# EAGLE design usb_to_uart (EAGLE 5.07)
P1: RX
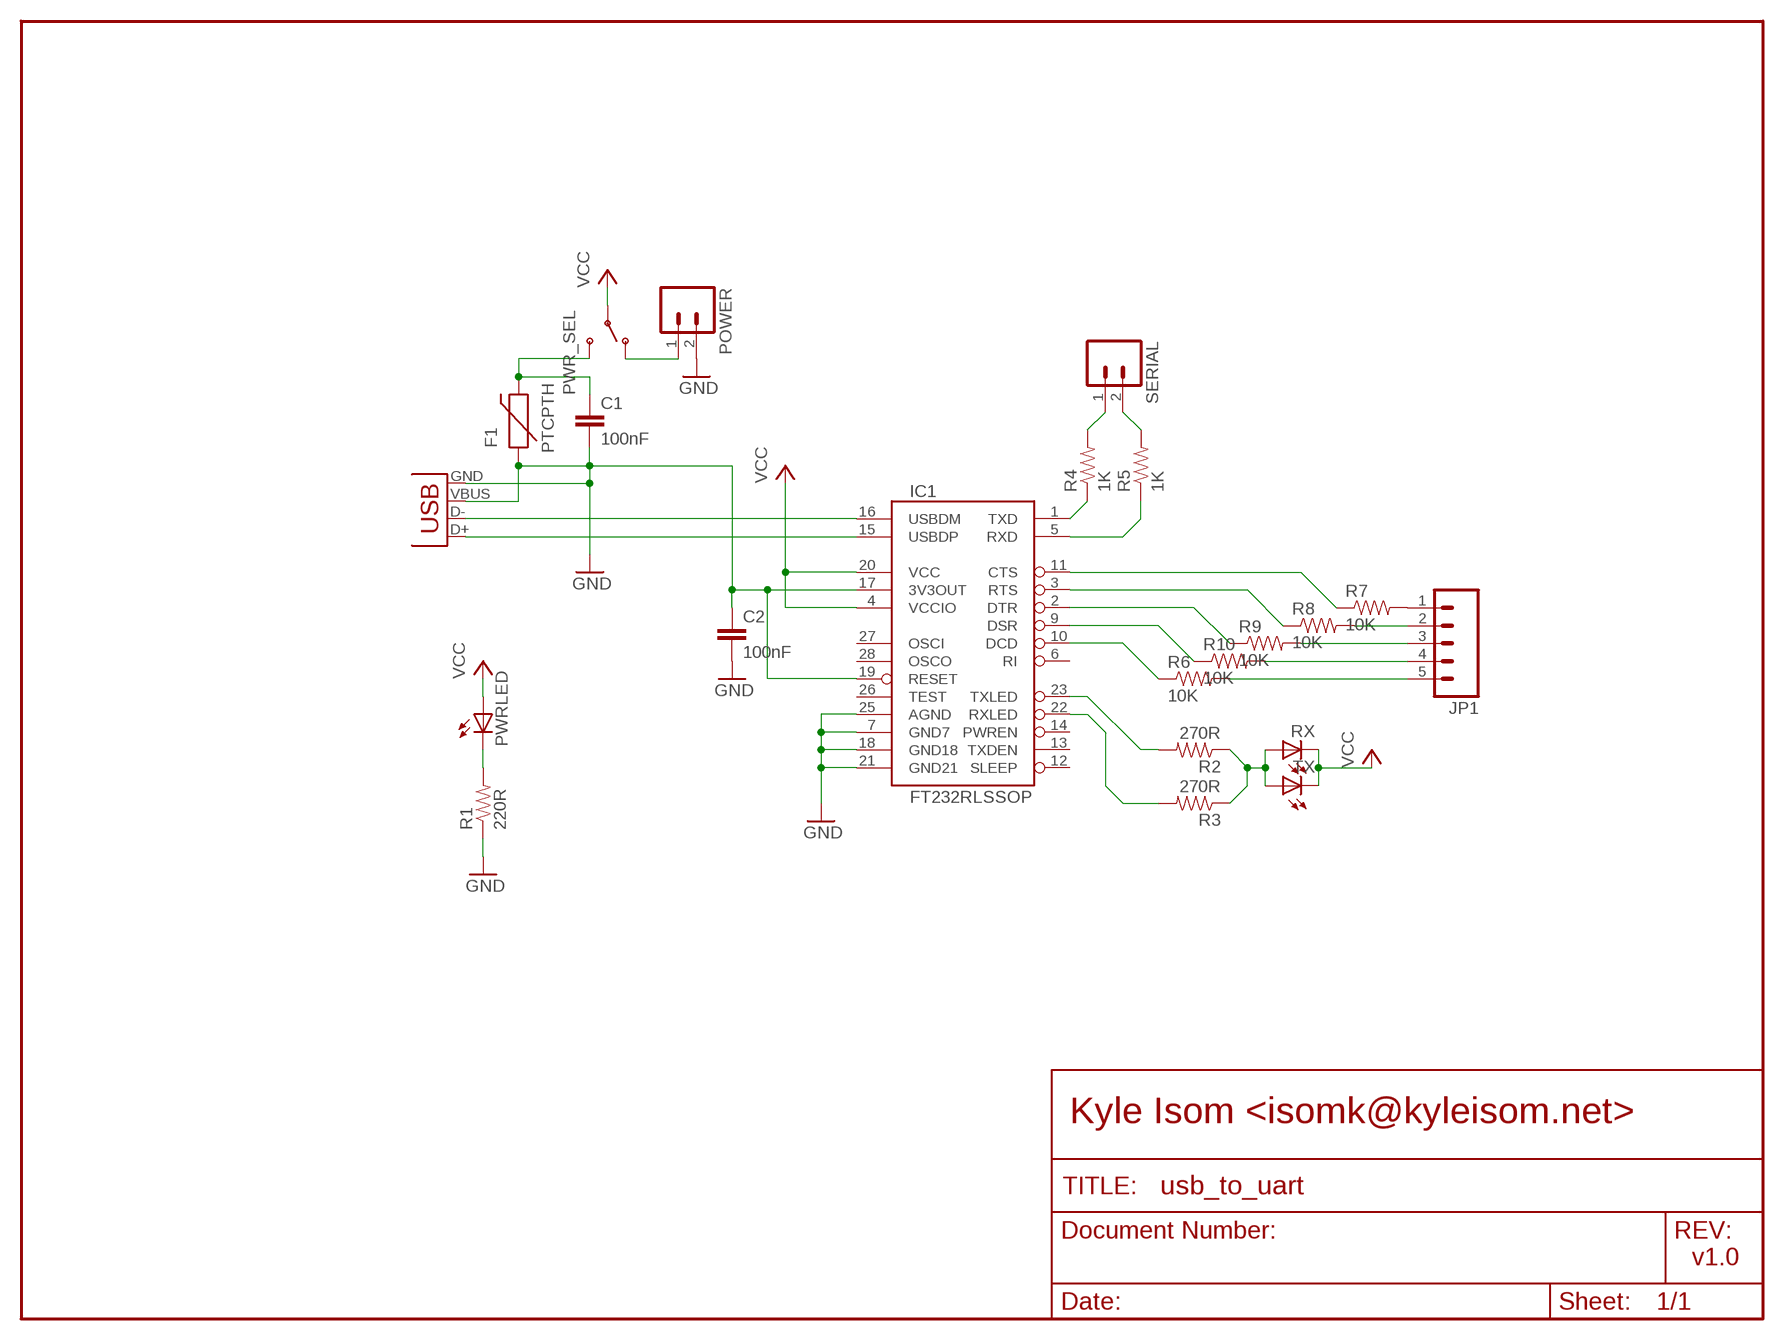
[diagram p0: schematic, sheet 1]

## Parts
C1  100nF  CAPPTH  [CAP-PTH-SMALL]
C2  100nF  CAPPTH  [CAP-PTH-SMALL]
F1  PTCPTH  [PTC]
IC1  FT232RLSSOP  [SSOP28DB]
JP1  M05LOCK  [1X05_LOCK]
POWER  M02POLAR_LOCK  [MOLEX-1X2_LOCK]
PWR_SEL  SWITCH-SPSTPTH_LOCK  [SWITCH-SPDT_LOCK.007S]
PWRLED  LED5MM  [LED5MM]
R1  220R  RESISTORPTH1  [AXIAL-0.3]
R2  270R  RESISTORPTH1  [AXIAL-0.3]
R3  270R  RESISTORPTH1  [AXIAL-0.3]
R4  1K  RESISTORPTH1  [AXIAL-0.3]
R5  1K  RESISTORPTH1  [AXIAL-0.3]
R6  10K  RESISTORPTH1  [AXIAL-0.3]
R7  10K  RESISTORPTH1  [AXIAL-0.3]
R8  10K  RESISTORPTH1  [AXIAL-0.3]
R9  10K  RESISTORPTH1  [AXIAL-0.3]
R10  10K  RESISTORPTH1  [AXIAL-0.3]
RX  LED5MM  [LED5MM]
SERIAL  M02LOCK  [1X02_LOCK]
TX  LED5MM  [LED5MM]
X1  USBSMD  [USB-MINIB]

## Nets
GND: C1.2 C2.1 C2.2 F1.P$1 IC1.7(GND7) IC1.17(3V3OUT) IC1.18(GND18) IC1.19(RESET) IC1.21(GND21) IC1.25(AGND) POWER.2 R1.P$1 X1.GND X1.VBUS
N$1: IC1.15(USBDP) X1.D+
N$2: IC1.16(USBDM) X1.D-
N$3: C1.1 F1.P$2 PWR_SEL.3(S)
N$4: IC1.1(TXD) R4.P$1
N$5: POWER.1 PWR_SEL.1(O)
N$6: R4.P$2 SERIAL.1
N$7: PWRLED.K(C) R1.P$2
N$8: IC1.22(RXLED) R3.P$2
N$9: IC1.3(RTS) R8.P$1
N$10: IC1.23(TXLED) R2.P$2
N$11: R5.P$2 SERIAL.2
N$12: IC1.11(CTS) R7.P$1
N$13: R2.P$1 R3.P$1 RX.A TX.A
N$14: JP1.1 R7.P$2
N$15: IC1.5(RXD) R5.P$1
N$16: JP1.2 R8.P$2
N$17: IC1.2(DTR) R9.P$1
N$18: JP1.3 R9.P$2
N$19: JP1.4 R10.P$2
N$20: IC1.9(DSR) R10.P$1
N$21: IC1.10(DCD) R6.P$1
N$22: JP1.5 R6.P$2
VCC: IC1.4(VCCIO) IC1.20(VCC) PWR_SEL.2(P) PWRLED.A RX.K(C) TX.K(C)
Unconnected: IC1.6(RI) IC1.12(SLEEP) IC1.13(TXDEN) IC1.14(PWREN) IC1.26(TEST) IC1.27(OSCI) IC1.28(OSCO)

## Notes on the sheet
- Kyle Isom <isomk@kyleisom.net>
- v1.0

## Library data of the parts
C1 C2 = SparkFun:CAP: Capacitor Standard 0603 ceramic capacitor, and 0.1" leaded capacitor.
F1 = SparkFun:PTC: Resettable Fuse PTC Resettable Fuse. Spark Fun Electronics SKU : COM-08357
IC1 = SparkFun:FT232RL: USB UART FT232RL 4th Generation USB UART (USB <-> Serial) Controller. Spark Fun Electronics SKU : COM-00650
JP1 = SparkFun:M05: Header 5 Standard 5-pin 0.1" header. Use with straight break away headers (SKU : PRT-00116), right angle break away headers (PRT-00553), swiss pins (PRT-00743), machine pins (PRT-00117), and female headers (PRT-00115). Molex polarized connector foot print use with SKU : PRT-08230 with associated crimp pins and housings.
POWER SERIAL = SparkFun:M02: Header 2 Standard 2-pin 0.1" header. Use with straight break away headers (SKU : PRT-00116), right angle break away headers (PRT-00553), swiss pins (PRT-00743), machine pins (PRT-00117), and female headers (PRT-00115). Molex polarized connector foot print use with SKU : PRT-08233 with associated crimp pins and housings.
PWR_SEL = SparkFun:SWITCH-SPST: SPST Switch Simple slide switch. Spark Fun Electronics SKU : COM-00102
PWRLED RX TX = led:LED: LED OSRAM: - CHIPLED LG R971, LG N971, LY N971, LG Q971, LY Q971, LO R971, LY R971 LH N974, LH R974 LS Q976, LO Q976, LY Q976 LO Q996 - Hyper CHIPLED LW Q18S LB Q993, LB Q99A, LB R99A - SideLED LS A670, LO A670, LY A670, LG A670, LP A670 LB A673, LV A673, LT A673, LW A673 LH A674 LY A675 LS A676, LA A676, LO A676, LY A676, LW A676 LS A679, LY A679, LG A679 - Hyper Micro SIDELED® LS Y876, LA Y876, LO Y876, LY Y876 LT Y87S - SmartLED LW L88C, LW L88S LB L89C, LB L89S, LG L890 LS L89K, LO L89K, LY L89K LS L896, LA L896, LO L896, LY L896 - TOPLED LS T670, LO T670, LY T670, LG T670, LP T670 LSG T670, LSP T670, LSY T670, LOP T670, LYG T670 LG T671, LOG T671, LSG T671 LB T673, LV T673, LT T673, LW T673 LH T674 LS T676, LA T676, LO T676, LY T676, LB T676, LH T676, LSB T676, LW T676 LB T67C, LV T67C, LT T67C, LS T67K, LO T67K, LY T67K, LW E67C LS E67B, LA E67B, LO E67B, LY E67B, LB E67C, LV E67C, LT E67C LW T67C LS T679, LY T679, LG T679 LS T770, LO T770, LY T770, LG T770, LP T770 LB T773, LV T773, LT T773, LW T773 LH T774 LS E675, LA E675, LY E675, LS T675 LS T776, LA T776, LO T776, LY T776, LB T776 LHGB T686 LT T68C, LB T68C - Hyper Mini TOPLED® LB M676 - Mini TOPLED Santana® LG M470 LS M47K, LO M47K, LY M47K Source: http://www.osram.convergy.de LUXEON: - LUMILED® LXK2-PW12-R00, LXK2-PW12-S00, LXK2-PW14-U00, LXK2-PW14-V00 LXK2-PM12-R00, LXK2-PM12-S00, LXK2-PM14-U00 LXK2-PE12-Q00, LXK2-PE12-R00, LXK2-PE12-S00, LXK2-PE14-T00, LXK2-PE14-U00 LXK2-PB12-K00, LXK2-PB12-L00, LXK2-PB12-M00, LXK2-PB14-N00, LXK2-PB14-P00, LXK2-PB14-Q00 LXK2-PR12-L00, LXK2-PR12-M00, LXK2-PR14-Q00, LXK2-PR14-R00 LXK2-PD12-Q00, LXK2-PD12-R00, LXK2-PD12-S00 LXK2-PH12-R00, LXK2-PH12-S00 LXK2-PL12-P00, LXK2-PL12-Q00, LXK2-PL12-R00 Source: www.luxeon.com KINGBRIGHT: KA-3528ASYC Source: www.kingbright.com
R1-R10 = SparkFun:RESISTOR: Resistor Basic schematic elements and footprints for 0603, 1206, and PTH 1/10th watt (small) resistors.
X1 = SparkFun:USB: USB Connectors USB-B-PTH is fully proven SKU : PRT-00139 USB-miniB is fully proven SKU : PRT-00587 USB-A-PCB is untested. USB-A-H is throughly reviewed, but untested. Spark Fun Electronics SKU : PRT-00437 USB-B-SMT is throughly reviewed, but untested. Needs silkscreen touching up. USB-A-S has not been used/tested USB-MB-H has not been used/tested

## Board
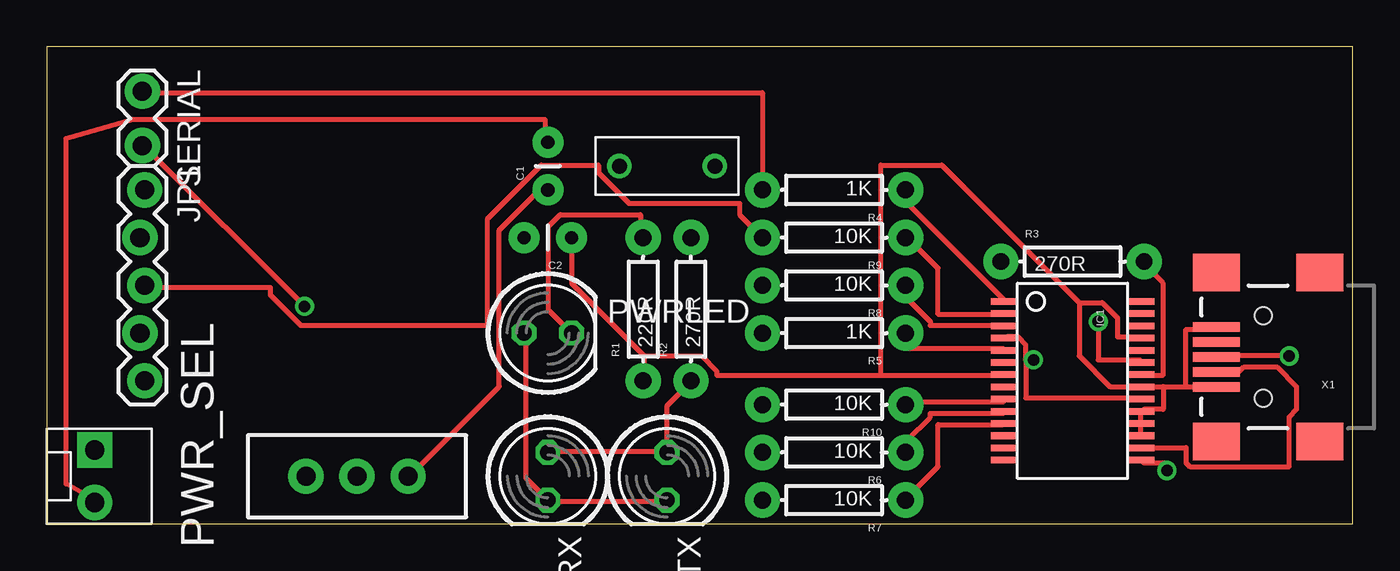
[diagram p1: board, top side]
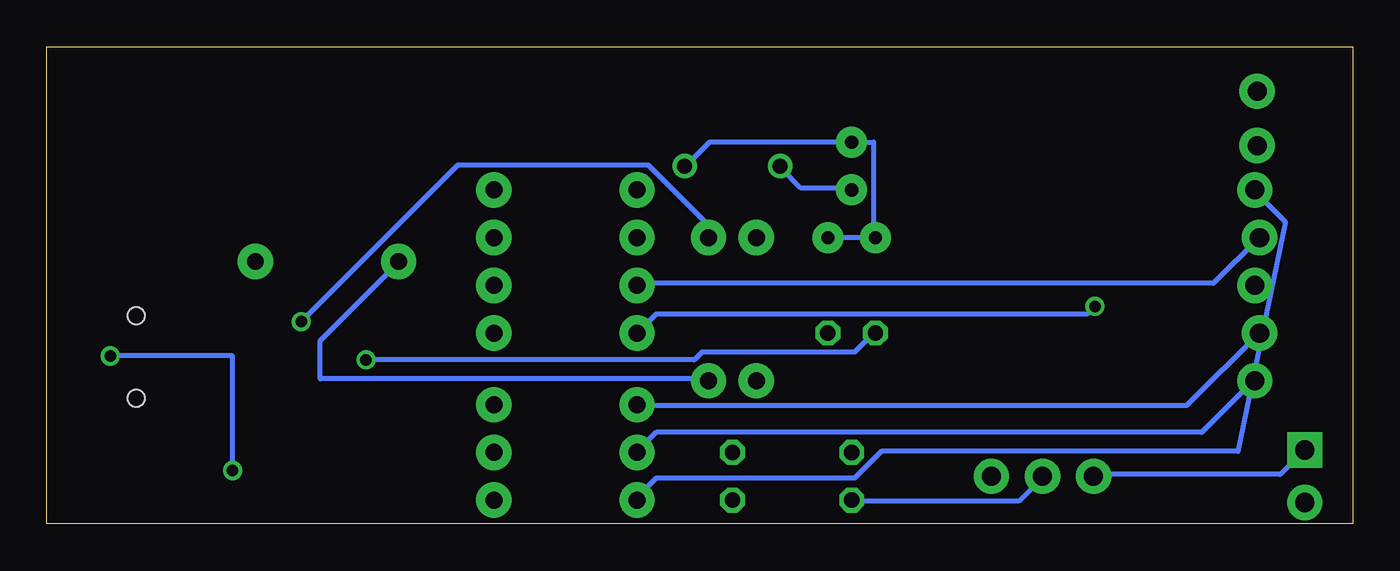
[diagram p2: board, bottom side, seen from below]

Size 69.52 x 25.39 mm. Coordinates in mm from the lower left corner, seen from the top.
Outline: 0,0 69.52,0 69.52,25.39 0,25.39 0,0
Copper layers (1*16): Top 0.035mm / dielectric 1.5mm / Bottom 0.035mm
Design rules "default": minimum track width 10mil, minimum drill 24mil, track to track 8mil, track to pad 8mil, pad to pad 8mil, via to via 8mil, smd to smd 8mil, copper to edge 40mil, drill to drill 8mil, minimum pad ring 10mil, minimum via ring 8mil, stop-mask expansion 4mil, vias tented up to drill 0mil, thermal gap 10mil

### Footprints (pad centres in the part's own frame; a part is rotated, then mirrored left to right if it is on the bottom)
CAP-PTH-SMALL = drill 0.7 pad 1.651 round: 1 0,0; 2 2.54,0
PTC = drill 0.8 round: P$1 -2.54,0; P$2 2.54,0
SSOP28DB = smd 0.348 x 1.397: 1 -4.225,-3.656; 2 -3.575,-3.656; 3 -2.925,-3.656; 4 -2.275,-3.656; 5 -1.625,-3.656; 6 -0.975,-3.656; 7 -0.325,-3.656; 8 0.325,-3.656; 9 0.975,-3.656; 10 1.625,-3.656; 11 2.275,-3.656; 12 2.925,-3.656; 13 3.575,-3.656; 14 4.225,-3.656; 15 4.225,3.656; 16 3.575,3.656; 17 2.925,3.656; 18 2.275,3.656; 19 1.625,3.656; 20 0.975,3.656; 21 0.325,3.656; 22 -0.325,3.656; 23 -0.975,3.656; 24 -1.625,3.656; 25 -2.275,3.656; 26 -2.925,3.656; 27 -3.575,3.656; 28 -4.225,3.656
1X05_LOCK = drill 1.016 pad 1.88 round: 1 0,0.127; 2 2.54,-0.127; 3 5.08,0.127; 4 7.62,-0.127; 5 10.16,0.127
MOLEX-1X2_LOCK = drill 1.016 pad 1.88 square: 1 -0.127,0 | drill 1.016 pad 1.88 round: 2 2.667,0
SWITCH-SPDT_LOCK.007S = drill 1.016 pad 1.88 round: 1 0,2.718; 2 0,0; 3 0,-2.718
LED5MM = drill 0.813 octagon: A -1.27,0; K 1.27,0
AXIAL-0.3 = drill 0.9 pad 1.88 round: P$1 -3.81,0; P$2 3.81,0
1X02_LOCK = drill 1.016 pad 1.88 round: 1 -0.178,0; 2 2.718,0
USB-MINIB = smd 2.5 x 0.5: D+ 2.5,0; D- 2.5,0.8; GND 2.5,-1.6; ID 2.5,-0.8; VBUS 2.5,1.6 | smd 2.5 x 2: GND@1 -3,-4.5; GND@2 -3,4.5; GND@3 2.5,4.5; GND@4 2.5,-4.5 | hole 0.9: 0,2.2; 0,-2.2

### Placement (x,y rotation side)
C1  26.67,17.78 90 top
C2  27.94,15.24 180 top
F1  33.02,19.05 180 top
IC1  54.61,7.62 270 top
JP1  5.08,17.78 270 top
POWER  2.54,3.81 270 top
PWR_SEL  16.51,2.54 90 top
PWRLED  26.67,10.16 0 top
R1  31.75,11.43 90 top
R2  34.29,11.43 90 top
R3  54.61,13.97 0 top
R4  41.91,17.78 180 top
R5  41.91,10.16 180 top
R6  41.91,3.81 180 top
R7  41.91,1.27 180 top
R8  41.91,12.7 180 top
R9  41.91,15.24 180 top
R10  41.91,6.35 180 top
RX  26.67,2.54 270 top
SERIAL  5.08,22.86 270 top
TX  33.02,2.54 270 top
X1  64.77,8.89 180 top

### Tracks (layer width: path | path; a pad name or v marks a point on that pad's centre or on a via)
GND
  Top 0.254: IC1.17 58.22,4.67 58.22,5.28 IC1.18 58.22,5.49 58.22,5.89 IC1.19 58.42,6.1 59.44,6.1 59.44,7.32 | 60.66,7.32 62.08,7.32 X1.VBUS | 59.44,7.32 60.66,7.32 | 59.44,7.32 58.42,7.32 IC1.21 58.22,7.32 56.59,7.32 54.97,8.94 54.97,11.79 | 54.97,11.79 56.19,11.79 57,10.97 57,9.96 58.22,9.96 IC1.25 | 60.66,7.32 60.66,10.36 62.08,10.36 X1.GND | 44.4,7.92 35.66,7.92 35.66,8.13 34.85,8.94 31.8,8.94 | 44.4,7.92 50.9,7.92 IC1.7 | 31.8,8.94 31.8,7.72 R1.P$1 | 54.97,11.79 47.65,19.1 44.4,19.1 44.4,7.92 | POWER.2 2.64,1.22 1.02,2.13 1.02,20.52 4.57,21.54 26.52,21.54 26.52,20.32 C1.2 | 31.8,8.94 27.94,12.8 C2.1
  Bottom 0.254: 25.5,15.24 C2.1 | F1.P$1 35.46,19.1 34.24,20.32 C1.2 25.5,20.32 25.5,15.24 | 25.5,15.24 C2.2
N$1  (via drill 0.61)
  Top 0.254: v59.64,2.85 59.64,3.25 58.42,3.25 IC1.15 | v66.14,8.94 62.28,8.94 X1.D+
  Bottom 0.254: v59.64,2.85 59.64,8.94 v66.14,8.94
N$2
  Top 0.254: IC1.16 58.42,4.06 60.66,4.06 60.66,3.25 60.86,3.05 66.14,3.05 66.14,5.69 66.55,6.1 66.55,7.32 65.53,8.33 63.7,8.33 63.5,8.13 62.28,8.13 X1.D-
N$3
  Top 0.254: PWR_SEL.3 19.41,2.64 24.08,7.32 24.08,15.65 26.11,17.68 26.52,17.68 C1.1
  Bottom 0.254: F1.P$2 30.38,18.9 29.36,17.88 26.72,17.88 C1.1
N$4
  Top 0.254: IC1.1 50.9,11.99 45.82,17.07 45.82,17.68 R4.P$1
N$5
  Bottom 0.254: POWER.1 2.64,3.86 3.86,2.64 13.72,2.64 PWR_SEL.1
N$6
  Top 0.254: SERIAL.1 5.18,22.96 38.1,22.96 R4.P$2
N$7
  Top 0.254: PWRLED.K 26.72,11.38 26.72,15.85 27.33,16.46 31.6,16.46 31.6,15.24 R1.P$2
N$8
  Top 0.254: IC1.22 58.42,7.92 59.44,7.92 59.44,12.8 58.42,13.82 R3.P$2
N$9
  Top 0.254: IC1.3 50.9,10.57 47.04,10.57 47.04,10.77 45.82,11.99 45.82,12.6 R8.P$1
N$10  (via drill 0.61)
  Top 0.254: v55.98,10.77 55.98,8.74 58.22,8.74 IC1.23
  Bottom 0.254: v55.98,10.77 47.65,19.1 37.49,19.1 34.44,16.05 34.44,15.24 R2.P$2
N$11  (via drill 0.61)
  Top 0.254: v13.72,11.58 5.18,20.12 SERIAL.2
  Bottom 0.254: v13.72,11.58 14.12,11.18 37.08,11.18 R5.P$2
N$12
  Top 0.254: IC1.11 50.9,5.28 47.45,5.28 47.45,3.05 45.82,1.42 R7.P$1
N$13
  Top 0.254: 33.02,3.86 26.72,3.86 RX.A | 33.02,3.86 33.02,6.3 34.24,7.52 R2.P$1 | 33.02,3.86 TX.A
  Bottom 0.254: R3.P$1 50.9,13.82 54.97,9.75 54.97,7.72 34.44,7.72 R2.P$1
N$14
  Bottom 0.254: JP1.1 5.18,17.68 3.56,16.05 6.1,3.86 25.09,3.86 26.52,2.44 37.08,2.44 38.1,1.42 R7.P$2
N$15
  Top 0.254: IC1.5 50.9,9.35 45.82,9.35 45.82,10.16 R5.P$1
N$16
  Bottom 0.254: JP1.2 4.98,15.24 7.42,12.8 38.1,12.8 R8.P$2
N$17
  Top 0.254: IC1.2 50.9,11.18 47.45,11.18 47.45,13.61 45.82,15.24 R9.P$1
N$18
  Top 0.254: R9.P$2 36.88,16.46 36.88,17.07 30.99,17.07 29.36,18.69 29.36,19.1 26.31,19.1 23.47,16.26 23.47,10.57 13.51,10.57 11.89,12.19 11.89,12.6 5.38,12.6 JP1.3
N$19
  Bottom 0.254: JP1.4 4.98,10.16 8.84,6.3 38.1,6.3 R10.P$2
N$20
  Top 0.254: IC1.9 50.9,6.5 45.82,6.5 R10.P$1
N$21
  Top 0.254: IC1.10 50.9,5.89 47.04,5.89 47.04,5.69 45.82,4.47 45.82,3.86 R6.P$1
N$22
  Bottom 0.254: JP1.5 5.38,7.52 8.03,4.88 37.08,4.88 38.1,3.86 R6.P$2
VCC  (via drill 0.61)
  Top 0.254: 52.12,8.74 52.12,9.55 51.71,9.96 51.1,9.96 IC1.4 | 52.12,8.74 52.12,6.71 58.22,6.71 IC1.20 | TX.K 33.02,1.22 26.72,1.22 RX.K 25.5,2.44 25.5,10.16 PWRLED.A | v52.53,8.74 52.12,8.74
  Bottom 0.254: PWR_SEL.2 16.56,2.44 17.78,1.22 26.52,1.22 RX.K | v52.53,8.74 35.05,8.74 34.65,9.14 26.52,9.14 25.5,10.16 PWRLED.A

### Text on the board
tOrigins: RX | USB to UART v1.0 | TX | UART | Kyle Isom | CTS | isomk@kyleisom.net | RTS | DTR | DSR | SERIAL | DCD | + | USB | 5V BUS | POWER | POWER SELECT